# Altium schematic sheet SENSOR.SchDoc
size A4; SheetNumber: 9; SheetTotal: 11
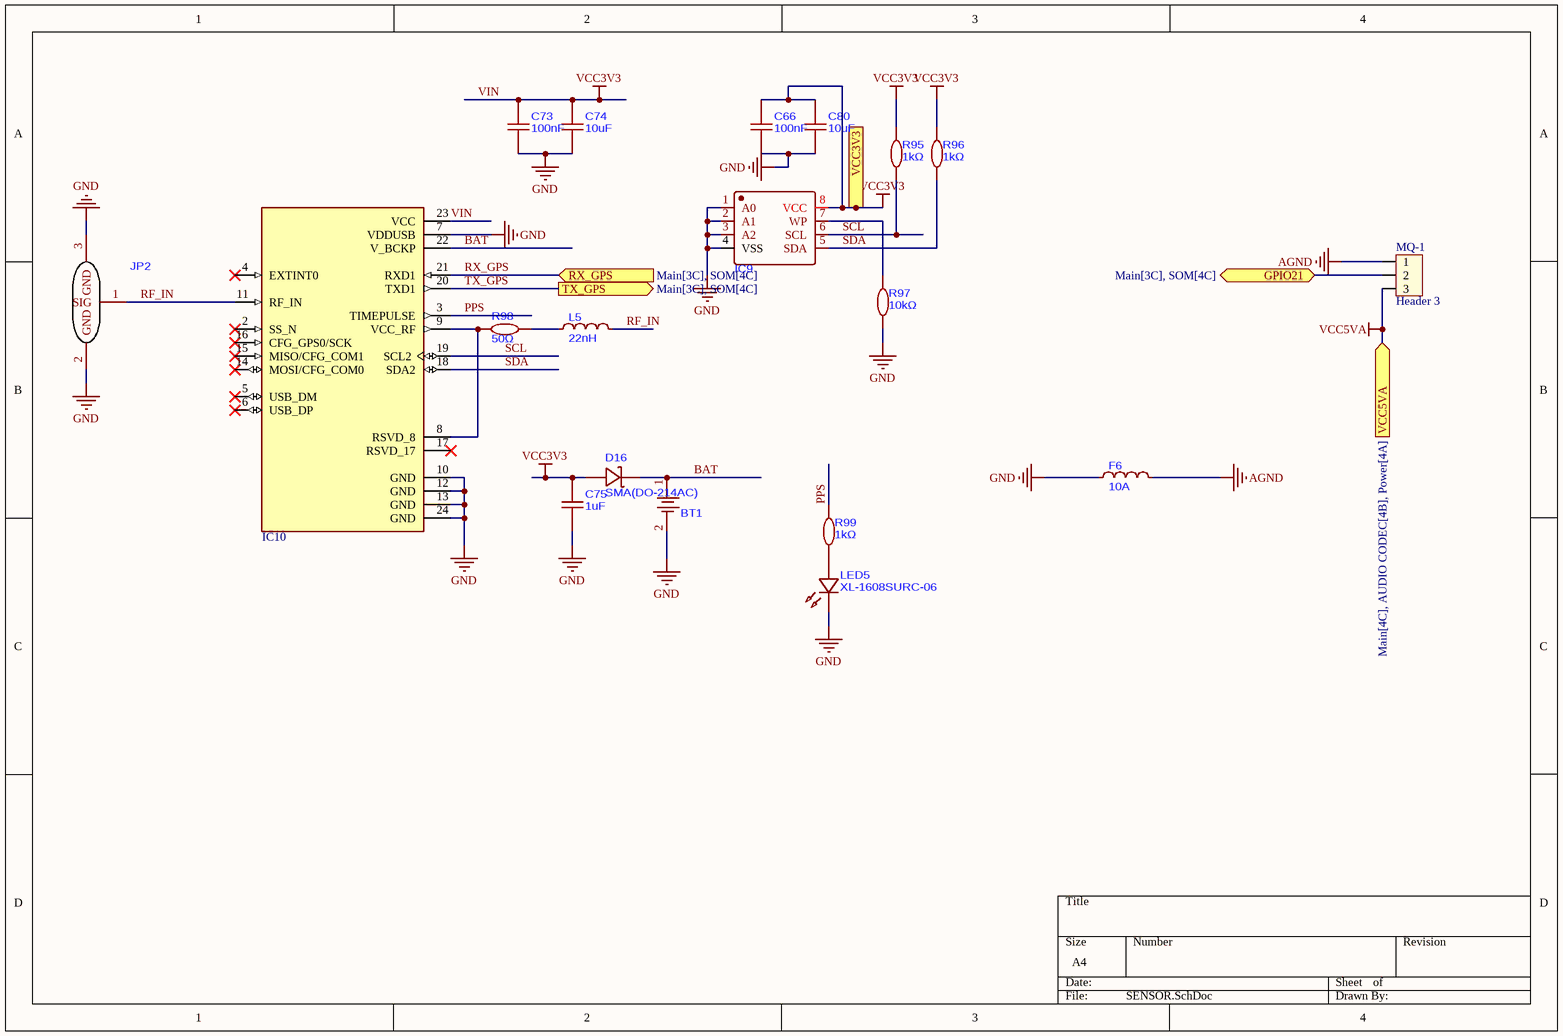
[diagram p0: SENSOR.SchDoc]

## Parts
BT1  BATTERY CLIP COIN CR2032 SMD  [BATTERY]  (value not drawn)
C66  100nF  [C0603]
C73  100nF  [C0603]
C74  10uF  [C0603]
C75  1uF  [C0603]
C80  10uF  [C0603]
D16  SMA(DO-214AC)  [SMA_L4.4-W2.6-LS5.0-RD]
F6  10A  [IND-SMD_L8.5-W3.1]
IC9  256 kb Serial CMOS EEPROM with I2C Protocol  [SOIC-8_L4.9-W3.9-P1.27-LS6.0-BL]  (value not drawn)
IC10  GPS NEO 6  [XCVR_NEO-6M-GPS]  (value not drawn)
JP2  CONN RCPT IPEX 50Ω SMD  [RF-SMD_FRF05002-JSS103M]  (value not drawn)
L5  22nH  [C0603]
LED5  XL-1608SURC-06  [LED0603-RD_RED]
MQ-1  Header 3  [HED3]
R95  1kΩ  [R0603]
R96  1kΩ  [R0603]
R97  10kΩ  [R0603]
R98  50Ω  [R0603]
R99  1kΩ  [R0603]

## Ports
GPIO21 (bidir, see Main[3C], SOM[4C]), RX_GPS (in, see Main[3C], SOM[4C]), TX_GPS (out, see Main[3C], SOM[4C]), VCC3V3 (in, see Main[4C], AUDIO CODEC[2C], Power[4C], SOM[4A], USB[4C]), VCC5VA (in, see Main[4C], AUDIO CODEC[4B], Power[4A])

## Nets
AGND: F6.2 MQ-1.1
GND: BT1.2 C66.1 C73.1 C74.1 C75.1 C80.1 F6.1 IC9.1(A0) IC9.2(A1) IC9.3(A2) IC9.4(VSS) IC10.7(VDDUSB) IC10.10(GND) IC10.12(GND) IC10.13(GND) IC10.24(GND) JP2.2(GND) JP2.3(GND) LED5.1(K) R97.1
VCC5VA: MQ-1.3 ; port VCC5VA
VIN: C66.2 C73.2 C74.2 C75.2 C80.2 D16.2(A) IC9.8(VCC) IC10.23(VCC) R95.2 R96.2 ; port VCC3V3  [also labelled VCC3V3]
BAT: BT1.1 D16.1(K) IC10.22(V_BCKP)
GPIO21: MQ-1.2 ; port GPIO21
PPS: IC10.3(TIMEPULSE) R99.2
RF_IN: IC10.11(RF_IN) JP2.1(SIG) L5.2
RX_GPS: IC10.21(RXD1) ; port RX_GPS
SCL: IC9.6(SCL) IC10.19(SCL2) R95.1
SDA: IC9.5(SDA) IC10.18(SDA2) R96.1
TX_GPS: IC10.20(TXD1) ; port TX_GPS
NetIC9_7: IC9.7(WP) R97.2
NetIC10_8: IC10.8(RSVD_8) IC10.9(VCC_RF) R98.1
NetL5_1: L5.1 R98.2
NetLED5_2: LED5.2(A) R99.1

Not connected (* = marked no-connect by the designer): IC10 2(SS_N)* 4(EXTINT0)* 5(USB_DM)* 6(USB_DP)* 14(MOSI/CFG_COM0)* 15(MISO/CFG_COM1)* 16(CFG_GPS0/SCK)* 17(RSVD_17)*

## Library data of the parts
BT1 = C70373: Battery Clip CR2032 SMD Blade Type Power Connector Assemblies RoHS
C66 C73 = CC0603KRX7R9BB104: 50V 100nF X7R ±10% 0603 Ceramic Capacitors ROHS
C74 C80 = CL10A106MA8NRNC: 25V 10uF X5R ±20% 0603 Ceramic Capacitors ROHS
C75 = CL10B105KA8NNNC: 25V 1uF X7R ±10% 0603 Ceramic Capacitors ROHS
D16 = B340A-13-F: 80A 40V 500mV@3A 3A SMA(DO-214AC) Single Diodes ROHS
F6 = HI3312X101R-10: 4mΩ 100Ω@100MHz SMD,8.5x3.1mm Ferrite Beads and Chips ROHS
IC9 = CAT24C256WI-GT3: 256Kbit 1.8V~5.5V 1MHz I2C SOIC-8 Memory (ICs) RoHS
IC10 = NEO-6M-GPS: GPS Development Tools SparkFun GNSS-RTK Dead Reckoning Breakout - ZED-F9K (Qwiic); MF: u-blox; SnapEDA_Link: https://www.snapeda.com/parts/NEO-6M-GPS/u-blox/view-part/?ref=snap; MP: NEO-6M-GPS; Availability: Not in stock; Price: None; Check_prices: https://www.snapeda.com/parts/NEO-6M-GPS/u-blox/view-part/?ref=eda; Value: *; Package: None
JP2 = U.FL-R-SMT-1(80): 1 Male Pin IPEX Board Side 1.25mm -40℃~+90℃ 6GHz 50Ω 2mm SMD Coaxial Connector (RF) Assemblies RoHS
L5 = VHF160808H22NJT: 300mA 22nH ±5% 600mΩ 0603 Fixed Inductors RoHS
LED5 = XL-1608SURC-06: 20mA 2.3V Red 50mW 0603 LED Indication - Discrete ROHS
MQ-1 = Hed3: Header 3 (Green); Value: Header 3
R95 R96 R99 = RMC 0603 1K J N: 100mW 1kΩ 50V ±100ppm/℃ Thick Film Resistor ±5% 0603 Chip Resistor - Surface Mount ROHS
R97 = RC0603FR-0710KL: 100mW 10kΩ 75V ±100ppm/℃ Thick Film Resistor ±1% 0603 Chip Resistor - Surface Mount ROHS
R98 = RT0603BRE0750RL: 100mW 50Ω 75V ±50ppm/℃ Thin Film Resistor ±0.1% 0603 Chip Resistor - Surface Mount ROHS